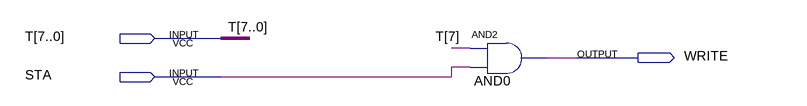
[diagram p0: schematic sheet]
// Quartus schematic WRITE.bdf as structural Verilog: 1 symbols, 3 pins
module WRITE (
  input  [7:0] T,
  input  STA,
  output WRITE
);

  and AND0 (WRITE, T[7], STA);
endmodule
